# Altium schematic sheet SensorInterface.SchDoc
size B; DocumentNumber: 4; SheetNumber: 4; SheetTotal: 14; PAGE_TITLE: -
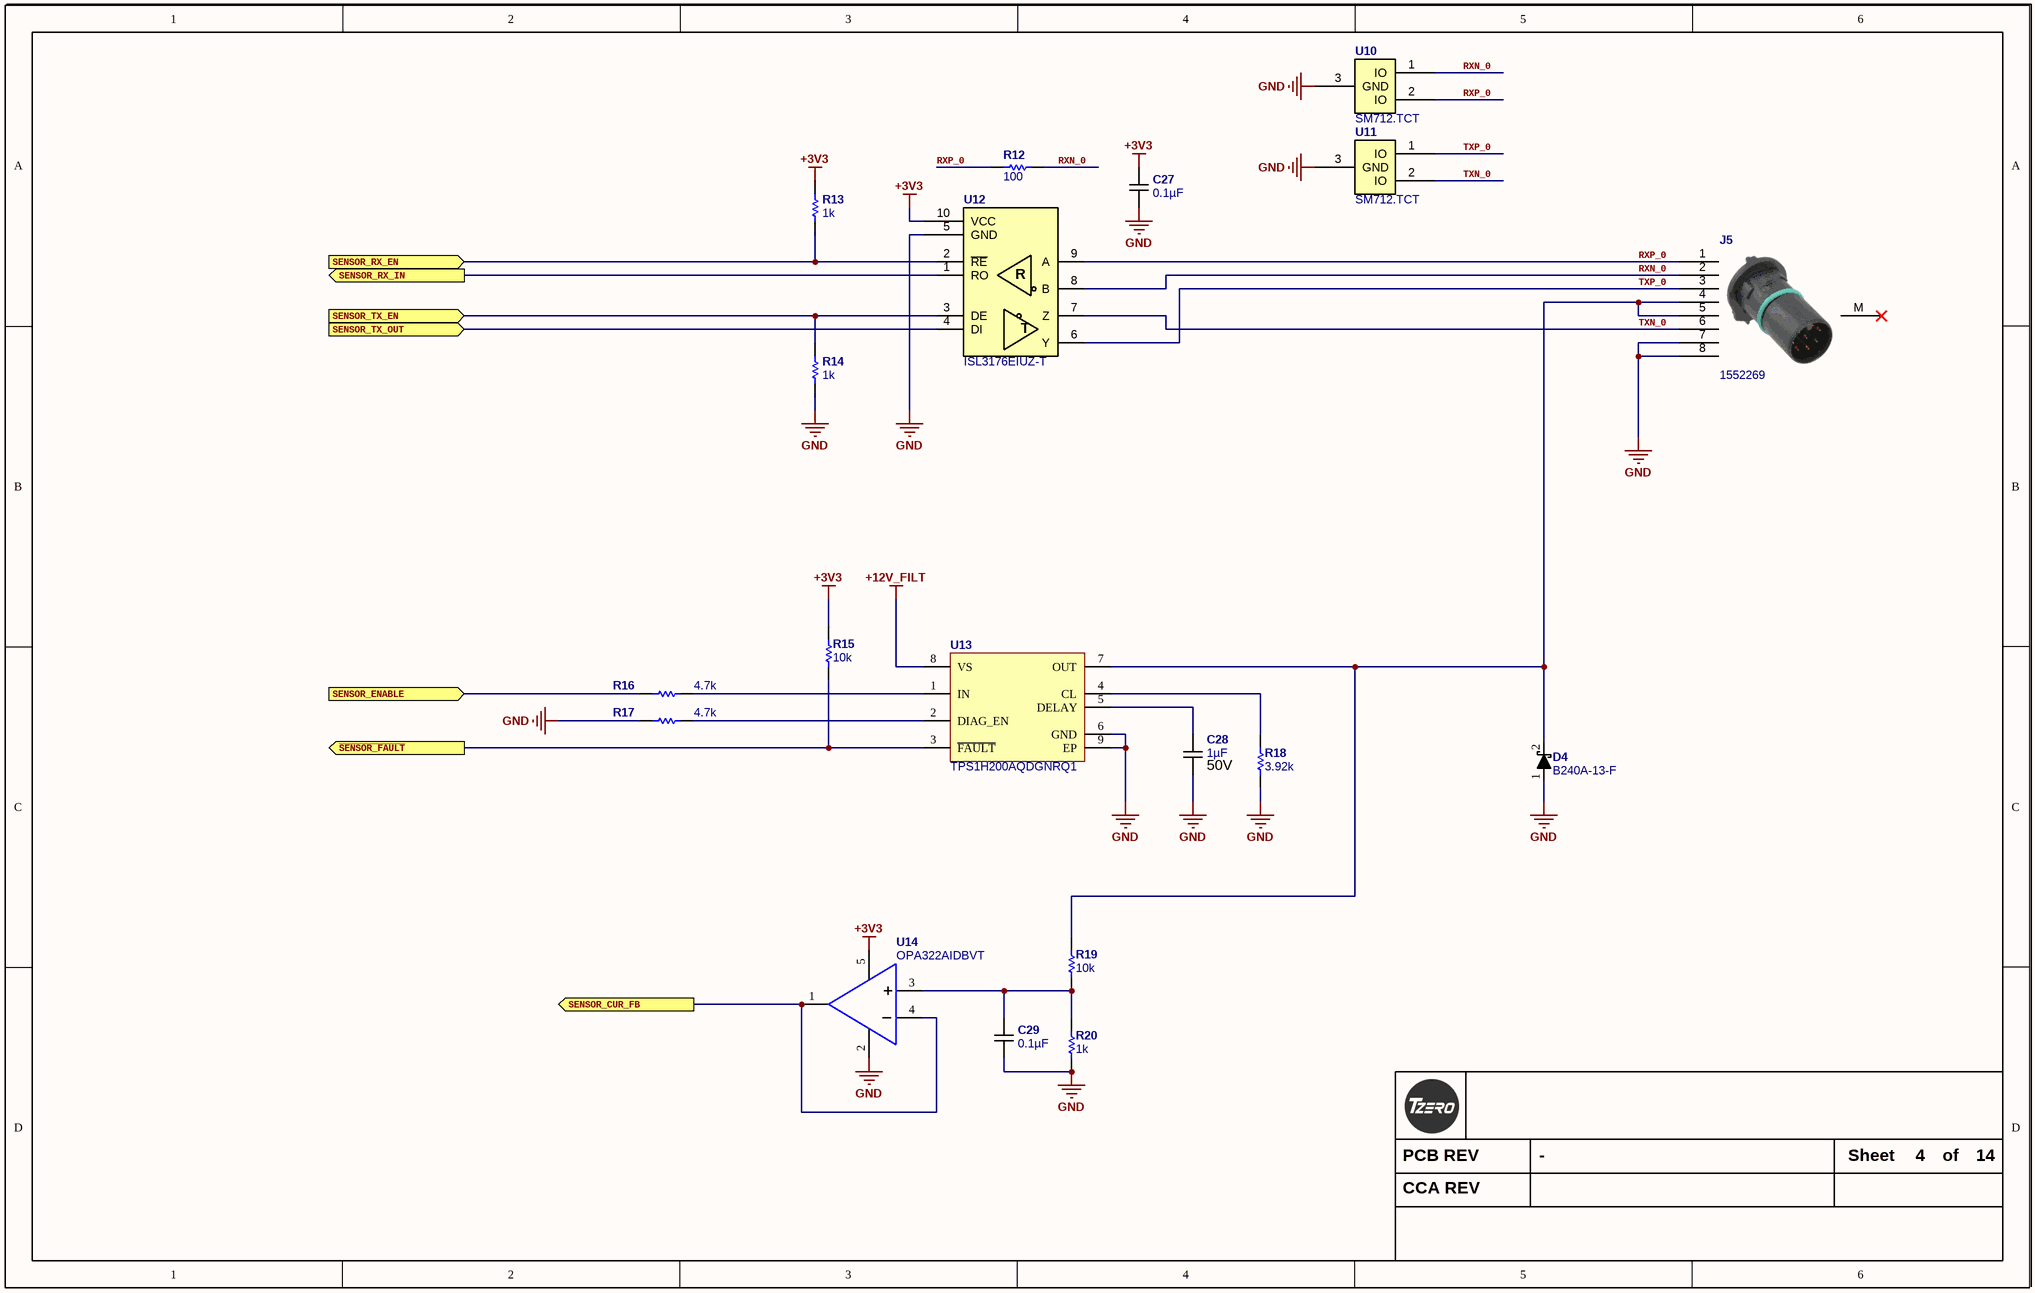
[diagram p0: SensorInterface.SchDoc]

## Parts
C27  0.1µF  [C0402_0.55MM_HD]
C28  1µF  Voltage - Rated: 50V  [C0805_1.50MM_MD]
C29  0.1µF  [C0402_0.55MM_HD]
D4  B240A-13-F  [D_SMA_P]
J5  1552269  [1552269]
R12  100  [R0603_0.55MM_MD]
R13  1k  [R0603_0.55MM_MD]
R14  1k  [R0603_0.55MM_MD]
R15  10k  [R0603_0.55MM_MD]
R16  4.7k  [R0603_0.55MM_MD]
R17  4.7k  [R0603_0.55MM_MD]
R18  3.92k  [R0603_0.55MM_MD]
R19  10k  [R0603_0.55MM_MD]
R20  1k  [R0603_0.55MM_MD]
U10  SM712.TCT  [SOT-23]
U11  SM712.TCT  [SOT-23]
U12  ISL3176EIUZ-T  [10 MSOP]
U13  TPS1H200AQDGNRQ1  [TI_DGN_MD]
U14  OPA322AIDBVT  [SOT23-5]

## Ports
SENSOR_CUR_FB (out), SENSOR_ENABLE (in), SENSOR_RX_EN (in), SENSOR_RX_IN (out), SENSOR_TX_EN (in), SENSOR_TX_OUT (in), ~{SENSOR_FAULT} (out)

## Nets
+3V3: C27.2 R13.1 R15.2 U12.10(VCC) U14.5(VCC)
+12V_FILT: U13.8(VS)
GND: C27.1 C28.1 C29.1 D4.1(A) J5.7 J5.8 R14.2 R17.1 R18.1 R20.2 U10.3(GND) U11.3(GND) U12.5(GND) U13.6(GND) U13.9(EP) U14.2(GND)
~{SENSOR_FAULT}: R15.1 U13.3(~{FAULT}) ; port ~{SENSOR_FAULT}
RXN_0: J5.2 R12.2 U10.1(IO) U12.8(B)
RXP_0: J5.1 R12.1 U10.2(IO) U12.9(A)
SENSOR_CUR_FB: U14.1(OUT) U14.4(-) ; port SENSOR_CUR_FB
SENSOR_ENABLE: R16.1 ; port SENSOR_ENABLE
SENSOR_RX_EN: R13.2 U12.2(~{RE}) ; port SENSOR_RX_EN
SENSOR_RX_IN: U12.1(RO) ; port SENSOR_RX_IN
SENSOR_TX_EN: R14.1 U12.3(DE) ; port SENSOR_TX_EN
SENSOR_TX_OUT: U12.4(DI) ; port SENSOR_TX_OUT
TXN_0: J5.6 U11.2(IO) U12.7(Z)
TXP_0: J5.3 U11.1(IO) U12.6(Y)
NetC28_2: C28.2 U13.5(DELAY)
NetC29_2: C29.2 R19.1 R20.1 U14.3(+)
NetD4_2: D4.2(K) J5.4 J5.5 R19.2 U13.7(OUT)
NetR16_2: R16.2 U13.1(IN)
NetR17_2: R17.2 U13.2(DIAG_EN)
NetR18_2: R18.2 U13.4(CL)

Not connected (* = marked no-connect by the designer): J5 M*

## Notes on the sheet
- PCB REV
- Sheet
- of
- CCA REV
- (in symbol ISL3176EIUZ-T) R; T

## Library data of the parts
C27 C29 = CGA2B3X7R1E104K050BB: CAP CER 0.1UF 25V X7R 0402; Manufacturer: TDK Corporation; Tolerance: ±10%; Substitution Notes: 0.1µF , 25V , ±10% , X7R , -55°C ~ 125°C , AEC-Q200 , 0402; Value: 0.1µF; Temperature Coefficient: X7R; Manufacturer Part Number: CGA2B3X7R1E104K050BB; ComponentLink1Description: Datasheet (Internal); ComponentLink1URL: datasheets\TDK\mlcc_automotive_general_en.pdf; ComponentLink2Description: Datasheet (External); ComponentLink2URL: https://product.tdk.com/info/en/catalog/datasheets/mlcc_automotive_general_en.pdf; Supplier 1: Digikey; Supplier Part Number 1: 445-6902-1-ND; Category: Capacitors; Voltage - Rated: 25V; Features: -; Operating Temperature: -55°C ~ 125°C; Ratings: AEC-Q200; Package: 0402; Thickness (Max): 0.55MM
C28 = CGA4J3X7R1H105M125AE: CAP CER 1UF 50V X7R 0805; Manufacturer: TDK Corporation; Tolerance: ±20%; Substitution Notes: 1µF , 50V , ±20% , X7R , -55°C ~ 125°C , AEC-Q200 , 0805; Value: 1µF; Temperature Coefficient: X7R; Manufacturer Part Number: CGA4J3X7R1H105M125AE; ComponentLink1Description: Datasheet (Internal); ComponentLink1URL: datasheets\TDK\mlcc_automotive_general_en.pdf; ComponentLink2Description: Datasheet (External); ComponentLink2URL: https://product.tdk.com/info/en/catalog/datasheets/mlcc_automotive_general_en.pdf; Supplier 1: Digikey; Supplier Part Number 1: 445-7958-1-ND; Category: Capacitors; Features: Soft Termination; Operating Temperature: -55°C ~ 125°C; Ratings: AEC-Q200; Package: 0805; Thickness (Max): 1.50MM
D4 = B240A-13-F: DIODE SCHOTTKY 40V 2A SMA; Manufacturer: Diodes Inc; CategorySort: 400; Voltage - Forward (Vf) (Max) @ If: 500mV @ 2A; Speed: Fast Recovery =< 500ns- > 200mA (Io); Current - Reverse Leakage @ Vr: 500µA @ 40V; Capacitance @ Vr- F: 200pF @ 4V- 1MHz; Num Pins: 2; Diode Suffix: 1A_2C; Category: Diodes; Value: B240A-13-F; Manufacturer Part Number: B240A-13-F; ComponentLink1Description: Internal Datasheet; ComponentLink1URL: http://www.diodes.com/datasheets/ds13004.pdf; ComponentLink2Description: External Datasheet; ComponentLink2URL: http://www.diodes.com/datasheets/ds13004.pdf; Stocked: -; Supplier 1: Digi-Key; Supplier Part Number 1: B240A-FDICT-ND; SortValue: B240A-13-F; Pricing: 1 = 0.54  ;  10 = 0.38  ;  25 = 0.312  ;  100 = 0.2492  ;  250 = 0.18152  ;  500 = 0.1474  ;  1000 = 0.1133  ;  2500 = 0.10175 (USD); Sales Status: Active; Diode Type: Schottky; Voltage - DC Reverse (Vr) (Max): 40V; Current - Average Rectified (Io): 2A; Reverse Recovery Time (trr): -; Mounting Type: Surface Mount; Package: DO-214AC- SMA; Supplier Device Package: SMA; Packaging: Cut Tape (CT)
J5 = 1552269: Circular Metric Connectors SACC-DSI-FSD -4CON-PG9/0,5 SCO; Manufacturer: Phoenix Contact; Current Rating: 2A; Voltage Rating: 30V; Number of Positions: 8; Connector Type: Plug; Strain Relief: No (Without); Thread Size: M12; Ratings: IP67,Waterproof,Dust Tight; Value: 1552269; Supplier 1: Digi-Key; Supplier Part Number 1: 277-8390-ND; Manufacturer Part Number: 1552269; RoHS: Yes; Category: Circular Connectors; Stock: 60; Pricing: 1=11.18000, 10=10.69000, 50=10.39880, 100=9.71850, 250=8.94108, 500=8.26078, 1000=7.87201 (USD); Mount: Through Hole; Weight: 0.128397oz; Contact Plating: Gold; Contact Material: Brass; Min Operating Temperature: -25°C; Max Operating Temperature: 85°C; Packaging: Tray; Package Quantity: 1; Fastening Type: Threaded; Termination: Solder; Number of Contacts: 8; Max Current Rating: 2A; Contact Gender: Female; Orientation: Straight; Radiation Hardening: No; Lead Free: Lead Free; ComponentLink1URL: https://datasheet.ciiva.com/15179/getdatasheetpartid-320397-15179574.pdf?src-supplier=Verical; ComponentLink1Description: https://datasheet.ciiva.com/15179/getdatasheetpartid-320397-15179574.pdf?src-supplier=Verical
R12 = ERJ-3EKF1000V: RES 100 OHM 1/10W 1% 0603 SMD; Manufacturer: Panasonic Electronic Components; Package Power: 0603  (0.1W); Power (Watts): 0.1W- 1/10W; Temperature Coefficient: ±100ppm/°C; Limiting Element Voltage: 75; Maximum Overload Voltage: 150; Maximum Working Voltage: 3.2V; Substitution Notes: 100 , ±1% , 0603 , AEC-Q200; Value: 100; Manufacturer Part Number: ERJ-3EKF1000V; ComponentLink1Description: Internal Datasheet; ComponentLink1URL: datasheets\Panasonic Electronic Components\AOA0000CE2.pdf; ComponentLink2Description: External Datasheet; ComponentLink2URL: http://industrial.panasonic.com/www-data/pdf/AOA0000/AOA0000CE2.pdf; Supplier 1: Digi-Key; Supplier Part Number 1: P100HCT-ND; Category: Resistors; Resistance (Ohms): 100; Composition: Thick Film; Features: -; Tolerance: ±1%; Package: 0603 (1608 Metric); Supplier Package: 0603; Size / Dimension: 0.063" L x 0.031" W (1.60mm x 0.80mm); Height: 0.55MM; Number of Terminations: 2; Packaging: Cut Tape (CT); Sort Value: 100; Sort Value Package: 603_100; Ratings: AEC-Q200
R13 R14 R20 = ERJ-3EKF1001V: RES 1K OHM 1/10W 1% 0603 SMD; Manufacturer: Panasonic Electronic Components; Package Power: 0603  (0.1W); Power (Watts): 0.1W- 1/10W; Temperature Coefficient: ±100ppm/°C; Limiting Element Voltage: 75; Maximum Overload Voltage: 150; Maximum Working Voltage: 10.0V; Substitution Notes: 1k , ±1% , 0603 , AEC-Q200; Value: 1k; Manufacturer Part Number: ERJ-3EKF1001V; ComponentLink1Description: Internal Datasheet; ComponentLink1URL: datasheets\Panasonic Electronic Components\AOA0000CE2.pdf; ComponentLink2Description: External Datasheet; ComponentLink2URL: http://industrial.panasonic.com/www-data/pdf/AOA0000/AOA0000CE2.pdf; Supplier 1: Digi-Key; Supplier Part Number 1: P1.00KHCT-ND; Category: Resistors; Resistance (Ohms): 1k; Composition: Thick Film; Features: -; Tolerance: ±1%; Package: 0603 (1608 Metric); Supplier Package: 0603; Size / Dimension: 0.063" L x 0.031" W (1.60mm x 0.80mm); Height: 0.55MM; Number of Terminations: 2; Packaging: Cut Tape (CT); Sort Value: 1000; Sort Value Package: 603_1000; Ratings: AEC-Q200
R15 R19 = ERJ-3EKF1002V: RES 10K OHM 1/10W 1% 0603 SMD; Manufacturer: Panasonic Electronic Components; Package Power: 0603  (0.1W); Power (Watts): 0.1W- 1/10W; Temperature Coefficient: ±100ppm/°C; Limiting Element Voltage: 75; Maximum Overload Voltage: 150; Maximum Working Voltage: 31.6V; Substitution Notes: 10k , ±1% , 0603 , AEC-Q200; Value: 10k; Manufacturer Part Number: ERJ-3EKF1002V; ComponentLink1Description: Internal Datasheet; ComponentLink1URL: datasheets\Panasonic Electronic Components\AOA0000CE2.pdf; ComponentLink2Description: External Datasheet; ComponentLink2URL: http://industrial.panasonic.com/www-data/pdf/AOA0000/AOA0000CE2.pdf; Supplier 1: Digi-Key; Supplier Part Number 1: P10.0KHCT-ND; Category: Resistors; Resistance (Ohms): 10k; Composition: Thick Film; Features: -; Tolerance: ±1%; Package: 0603 (1608 Metric); Supplier Package: 0603; Size / Dimension: 0.063" L x 0.031" W (1.60mm x 0.80mm); Height: 0.55MM; Number of Terminations: 2; Packaging: Cut Tape (CT); Sort Value: 10000; Sort Value Package: 603_10000; Ratings: AEC-Q200
R16 R17 = ERJ-3EKF4701V: RES 4.7K OHM 1/10W 1% 0603 SMD; Manufacturer: Panasonic Electronic Components; Package Power: 0603  (0.1W); Power (Watts): 0.1W- 1/10W; Temperature Coefficient: ±100ppm/°C; Limiting Element Voltage: 75; Maximum Overload Voltage: 150; Maximum Working Voltage: 21.7V; Substitution Notes: 4.7k , ±1% , 0603 , AEC-Q200; Value: 4.7k; Manufacturer Part Number: ERJ-3EKF4701V; ComponentLink1Description: Internal Datasheet; ComponentLink1URL: datasheets\Panasonic Electronic Components\AOA0000CE2.pdf; ComponentLink2Description: External Datasheet; ComponentLink2URL: http://industrial.panasonic.com/www-data/pdf/AOA0000/AOA0000CE2.pdf; Supplier 1: Digi-Key; Supplier Part Number 1: P4.70KHCT-ND; Category: Resistors; Resistance (Ohms): 4.7k; Composition: Thick Film; Features: -; Tolerance: ±1%; Package: 0603 (1608 Metric); Supplier Package: 0603; Size / Dimension: 0.063" L x 0.031" W (1.60mm x 0.80mm); Height: 0.55MM; Number of Terminations: 2; Packaging: Cut Tape (CT); Sort Value: 4700; Sort Value Package: 603_4700; Ratings: AEC-Q200
R18 = ERJ-3EKF3921V: RES 3.92K OHM 1/10W 1% 0603 SMD; Manufacturer: Panasonic Electronic Components; Package Power: 0603  (0.1W); Power (Watts): 0.1W- 1/10W; Temperature Coefficient: ±100ppm/°C; Limiting Element Voltage: 75; Maximum Overload Voltage: 150; Maximum Working Voltage: 19.8V; Substitution Notes: 3.92k , ±1% , 0603 , AEC-Q200; Value: 3.92k; Manufacturer Part Number: ERJ-3EKF3921V; ComponentLink1Description: Internal Datasheet; ComponentLink1URL: datasheets\Panasonic Electronic Components\AOA0000CE2.pdf; ComponentLink2Description: External Datasheet; ComponentLink2URL: http://industrial.panasonic.com/www-data/pdf/AOA0000/AOA0000CE2.pdf; Supplier 1: Digi-Key; Supplier Part Number 1: P3.92KHCT-ND; Category: Resistors; Resistance (Ohms): 3.92k; Composition: Thick Film; Features: -; Tolerance: ±1%; Package: 0603 (1608 Metric); Supplier Package: 0603; Size / Dimension: 0.063" L x 0.031" W (1.60mm x 0.80mm); Height: 0.55MM; Number of Terminations: 2; Packaging: Cut Tape (CT); Sort Value: 3920; Sort Value Package: 603_3920; Ratings: AEC-Q200
U10 U11 = SM712.TCT: TVS DIODE 12VWM/7VWM SOT23; Manufacturer: Semtech; Direction: Bidirectional; Number of Elements: 2; Reverse Breakdown Voltage: 13.3V; Reverse Standoff Voltage: 12V; Min Breakdown Voltage: 7.5V; Clamping Voltage: 26V; Peak Pulse Power: 400W; Power Line Protection: No; Leakage Current: 1uA; Peak Pulse Current: 17A; Test Current: 1mA; ESD Protection: Yes; Max Reverse Leakage Current: 20uA; Element Configuration: Dual; ComponentLink1URL: https://datasheet.ciiva.com/16393/sm712-16393584.pdf; ComponentLink1Description: https://datasheet.ciiva.com/16393/sm712-16393584.pdf; ComponentLink2URL: https://datasheet.ciiva.com/339/sm712-339089.pdf; ComponentLink2Description: https://datasheet.ciiva.com/339/sm712-339089.pdf; ComponentLink3URL: https://datasheet.ciiva.com/339/sm712-339090.pdf; ComponentLink3Description: https://datasheet.ciiva.com/339/sm712-339090.pdf; ComponentLink4URL: https://datasheet.ciiva.com/339/sm712-339091.pdf; ComponentLink4Description: https://datasheet.ciiva.com/339/sm712-339091.pdf; ComponentLink5URL: https://datasheet.ciiva.com/18065/getdatasheetpartid-110620-18065348.pdf; ComponentLink5Description: https://datasheet.ciiva.com/18065/getdatasheetpartid-110620-18065348.pdf; ComponentLink6URL: https://datasheet.ciiva.com/25958/sm712-25958326.pdf; ComponentLink6Description: https://datasheet.ciiva.com/25958/sm712-25958326.pdf; ComponentLink7URL: https://datasheet.ciiva.com/5748/579001-5748455.pdf; ComponentLink7Description: https://datasheet.ciiva.com/5748/579001-5748455.pdf; ComponentLink8URL: https://datasheet.ciiva.com/8029/579001-8029931.pdf; ComponentLink8Description: https://datasheet.ciiva.com/8029/579001-8029931.pdf; Supplier 1: Digi-Key; Supplier Part Number 1: SM712CT-ND; Manufacturer Part Number: SM712.TCT; Stock 1: 46130; Pricing 1: 1=1.79, 10=1.615, 25=1.442, 100=1.2978, 250=1.1536, 500=1.0094, 1000=0.8364 (USD); Mount: Surface Mount; Case/Package: SOT-23; Number of Pins: 3; Min Operating Temperature: -55°C; Max Operating Temperature: 125°C; Packaging: Tape and Reel; Number of Bidirectional Channels: 2; Power Dissipation: 400W; Polarity: Bidirectional; Working Voltage: 12V; Max Breakdown Voltage: 13.3V; Max Power Dissipation: 400W; Voltage Rating (DC): 12V; Breakdown Voltage: 13.3V; Length: 2.9mm; Height: 0.95mm; Width: 1.3mm; Depth: 1.3mm; Radiation Hardening: No; REACH SVHC: No SVHC; Lead Free: Lead Free; Value: SM712.TCT
U12 = ISL3176EIUZ-T: IC TXRX RS422/485 20MBPS 10MSOP; Manufacturer: Intersil; Protocol: RS422, RS485; Number of Drivers/Receivers: 1/1; Duplex: Full; Voltage - Supply: 3 V ~ 3.6 V; Value: ISL3176EIUZ-T; Supplier 1: Digi-Key; Supplier Part Number 1: ISL3176EIUZ-TCT-ND; Manufacturer Part Number: ISL3176EIUZ-T; RoHS: RoHS Compliant; Category: Integrated Circuits (ICs); Stock 1: 9164; Pricing 1: 1=1.79, 10=1.61, 100=1.2944, 500=1.06348, 1000=0.88117 (USD); Packaging: Cut Tape (CT); Part Status: Active; Type: Transceiver; Data Rate: 20Mbps; Operating Temperature: -40°C ~ 85°C; Mounting Type: Surface Mount; Package / Case: 10-TFSOP, 10-MSOP (0.118", 3.00mm Width); Supplier Device Package: 10-MSOP; ComponentLink1URL: http://www.intersil.com/content/dam/intersil/documents/isl3/isl3170e-71e-72e-73e-74e-75e-76e-77e-78e.pdf; ComponentLink1Description: http://www.intersil.com/content/dam/intersil/documents/isl3/isl3170e-71e-72e-73e-74e-75e-76e-77e-78e.pdf
U13 = TPS1H200AQDGNRQ1: SINGLE CHANNEL HIGH SIDE POWER S; Manufacturer: Texas Instruments; Number of Channels: 1; CategorySort: 600; Supplier 1: Digi-Key; Manufacturer Part Number: TPS1H200AQDGNRQ1; Stock 1: 8489; Pricing 1: 1 = 1.59000, 10 = 1.43000, 100 = 1.14960, 500 = 0.94452, 1000 = 0.78259 (USD); RoHS: No; Min Operating Temperature: -40°C; Max Operating Temperature: 125°C; ComponentLink1URL: http://www.ti.com/lit/ds/symlink/tps1h200a-q1.pdf?src-supplier=Digi-Key; ComponentLink1Description: http://www.ti.com/lit/ds/symlink/tps1h200a-q1.pdf?src-supplier=Digi-Key; Supplier Part Number 1: 296-50416-1-ND; Category: Integrated Circuits; Value: TPS1H200AQDGNRQ1
U14 = OPA322AIDBVT: IC OPAMP GP 20MHZ RRO SOT23-5; Manufacturer: Texas Instruments; Number of Channels: 1; Min Supply Voltage: 1.8V; Max Supply Voltage: 5.5V; Slew Rate: 10V/µs; Input Bias Current: 10pA; Input Offset Voltage (Vos): 2mV; Voltage Gain: 130dB; Common Mode Rejection Ratio: 90dB; Operating Supply Current: 1.6mA; Nominal Supply Current: 1.5mA; Output Current per Channel: 65mA; Min Dual Supply Voltage: 900mV; Max Dual Supply Voltage: 2.75V; Power Supply Rejection Ratio (PSRR): 100dB; Max Frequency: 10MHz; Manufacturer Part Number: OPA322AIDBVT; Value: OPA322AIDBVT; Supplier 1: Digi-Key; Supplier Part Number 1: 296-29511-1-ND; RoHS: Yes; Category: Amplifiers - Op Amps, Buffer, Instrumentation; Stock: 3683; Pricing: 1=1.66000, 10=1.49500, 25=1.41000, 100=1.12800 (USD); Case/Package: SOT-23; Number of Pins: 5; Min Operating Temperature: -40°C; Max Operating Temperature: 125°C; Packaging: Tape and Reel; Package Quantity: 250; Number of Circuits: 1; Gain Bandwidth Product: 20MHz; Unity Gain Bandwidth Product: 20MHz; Number of Elements: 1; Max I/O Voltage: 2mV; Nominal Gain Bandwidth Product: 20MHz; Output Current: 65mA; Bandwidth: 20MHz; Number of Amplifiers: 1; Operating Supply Voltage: 2.75V; Length: 3.05mm; Height: 1.3mm; Width: 1.75mm; Radiation Hardening: No; Lead Free: Lead Free; REACH SVHC: No SVHC; ComponentLink1URL: https://datasheet.ciiva.com/1803/opa322-1803459.pdf?src-supplier=Digi-Key; ComponentLink1Description: https://datasheet.ciiva.com/1803/opa322-1803459.pdf?src-supplier=Digi-Key; ComponentLink2URL: https://datasheet.ciiva.com/7848/1481239-7848179.pdf?src-supplier=Element14; ComponentLink2Description: https://datasheet.ciiva.com/7848/1481239-7848179.pdf?src-supplier=Element14; ComponentLink3URL: https://datasheet.ciiva.com/1803/opa322-1803460.pdf?src-supplier=Digi-Key; ComponentLink3Description: https://datasheet.ciiva.com/1803/opa322-1803460.pdf?src-supplier=Digi-Key; ComponentLink4URL: https://datasheet.ciiva.com/1803/opa322-1803461.pdf?src-supplier=Digi-Key; ComponentLink4Description: https://datasheet.ciiva.com/1803/opa322-1803461.pdf?src-supplier=Digi-Key; ComponentLink5URL: https://datasheet.ciiva.com/14460/opa4322-14460092.pdf?src-supplier=Avnet; ComponentLink5Description: https://datasheet.ciiva.com/14460/opa4322-14460092.pdf?src-supplier=Avnet; ComponentLink6URL: https://datasheet.ciiva.com/48706/001071938-da-01-en-ic-opamp-gp-rr-opa322aidbvt-sot-23-5-tid-48706602.pdf?src-supplier=Conrad; ComponentLink6Description: https://datasheet.ciiva.com/48706/001071938-da-01-en-ic-opamp-gp-rr-opa322aidbvt-sot-23-5-tid-48706602.pdf?src-supplier=Conrad